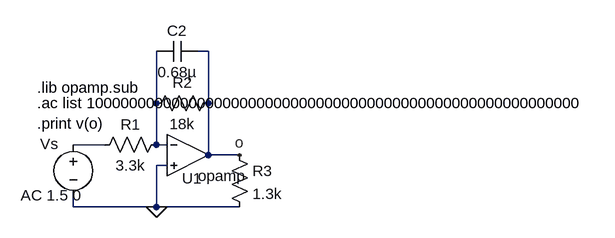
[diagram p0: schematic ECE2101L_Lab11_B2.asc]
ECE2101L_Lab11_B2.asc, the LTspice schematic file:
Version 4
SHEET 1 880 680
WIRE 208 -48 192 -48
WIRE 128 32 128 -48
WIRE 208 32 208 -48
WIRE 48 96 0 96
WIRE 128 96 128 32
WIRE 144 96 128 96
WIRE 208 112 208 32
WIRE 256 112 208 112
WIRE 144 128 128 128
WIRE 0 192 0 176
WIRE 128 192 128 128
WIRE 128 192 0 192
WIRE 256 192 128 192
FLAG 256 112 o
FLAG 128 192 0
SYMBOL voltage 0 80 R0
WINDOW 123 -81 94 Left 2
WINDOW 39 0 0 Left 0
WINDOW 0 -51 15 Left 2
SYMATTR Value2 AC 1.5 0
SYMATTR InstName Vs
SYMATTR Value ""
SYMBOL Opamps\\opamp 176 48 R0
WINDOW 0 -9 100 Left 2
SYMATTR InstName U1
SYMBOL res 32 112 R270
WINDOW 0 32 56 VTop 2
WINDOW 3 0 56 VBottom 2
SYMATTR InstName R1
SYMATTR Value 3.3k
SYMBOL res 112 48 R270
WINDOW 0 32 56 VTop 2
WINDOW 3 0 56 VBottom 2
SYMATTR InstName R2
SYMATTR Value 18k
SYMBOL cap 128 -32 R270
WINDOW 0 32 32 VTop 2
WINDOW 3 0 32 VBottom 2
SYMATTR InstName C2
SYMATTR Value 0.68µ
SYMBOL res 240 96 R0
SYMATTR InstName R3
SYMATTR Value 1.3k
TEXT -56 8 Left 2 !.lib opamp.sub
TEXT -56 32 Left 2 !.ac list 1000000000000000000000000000000000000000000000000000000000\n.print v(o)

The netlist it stands for:
* ECE2101L_Lab11_B2.asc
Vs N002 0 AC 1.5 0
XU1 N001 0 o opamp Aol=100K GBW=10Meg  ; pins invin noninvin out
R1 N002 N001 3.3k
R2 N001 o 18k
C2 N001 o 0.68µ
R3 o 0 1.3k
.lib opamp.sub
.ac list 1000000000000000000000000000000000000000000000000000000000
.print v(o)
.backanno
.end